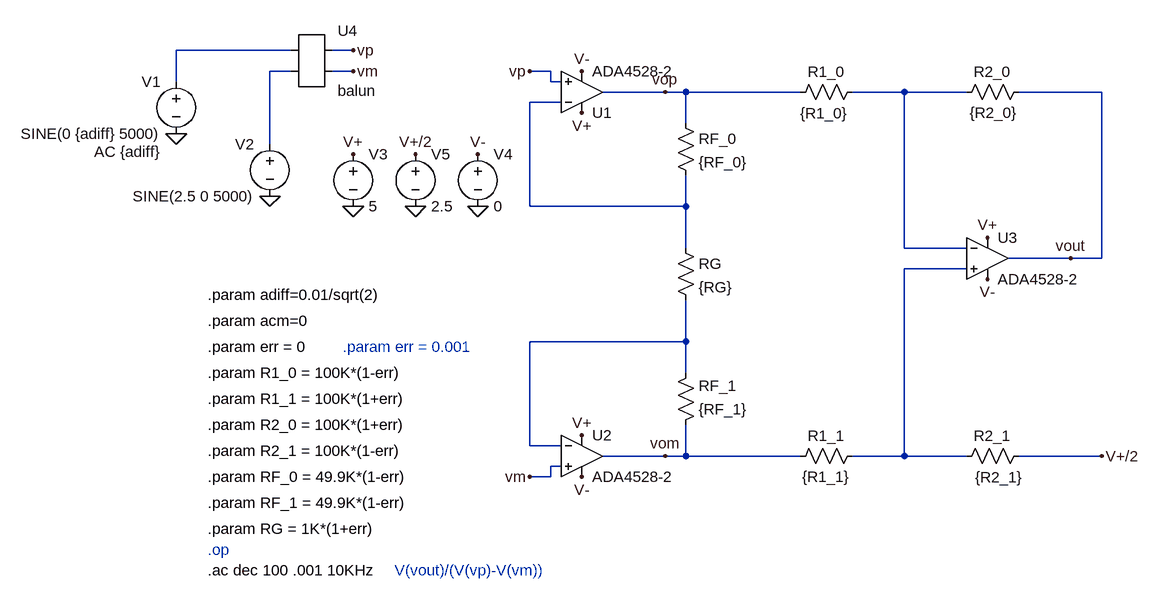
[diagram p0: schematic ADA4528_instrumentation_amp.asc]
ADA4528_instrumentation_amp.asc, the LTspice schematic file:
Version 4
SHEET 1 1708 1000
WIRE -256 96 -432 96
WIRE -160 96 -192 96
WIRE -256 128 -288 128
WIRE -160 128 -192 128
WIRE 144 128 112 128
WIRE -432 144 -432 96
WIRE 144 144 144 128
WIRE 160 144 144 144
WIRE 320 160 224 160
WIRE 352 160 320 160
WIRE 528 160 352 160
WIRE 688 160 608 160
WIRE 784 160 688 160
WIRE 992 160 864 160
WIRE 160 176 112 176
WIRE 352 208 352 160
WIRE -288 240 -288 128
WIRE 112 336 112 176
WIRE 352 336 352 288
WIRE 352 336 112 336
WIRE 352 400 352 336
WIRE 688 400 688 160
WIRE 784 400 688 400
WIRE 944 416 848 416
WIRE 992 416 992 160
WIRE 992 416 944 416
WIRE 784 432 688 432
WIRE 352 544 352 480
WIRE 352 544 112 544
WIRE 352 592 352 544
WIRE 112 704 112 544
WIRE 160 704 112 704
WIRE 320 720 224 720
WIRE 352 720 352 672
WIRE 352 720 320 720
WIRE 528 720 352 720
WIRE 688 720 688 432
WIRE 688 720 608 720
WIRE 784 720 688 720
WIRE 992 720 864 720
WIRE 160 736 144 736
WIRE 144 752 144 736
WIRE 144 752 112 752
FLAG 32 336 0
FLAG -160 336 0
FLAG -160 256 V+
FLAG 32 256 V-
FLAG 320 160 vop
FLAG 320 720 vom
FLAG 944 416 vout
FLAG 112 128 vp
FLAG 112 752 vm
FLAG -432 224 0
FLAG -160 96 vp
FLAG -160 128 vm
FLAG -288 320 0
FLAG 192 128 V-
FLAG 192 688 V+
FLAG 192 752 V-
FLAG 192 192 V+
FLAG 816 384 V+
FLAG 816 448 V-
FLAG -64 256 V+/2
FLAG -64 336 0
FLAG 992 720 V+/2
SYMBOL res 336 192 R0
SYMATTR InstName RF_0
SYMATTR Value {RF_0}
SYMBOL voltage -160 240 R0
WINDOW 123 24 44 Left 2
WINDOW 39 0 0 Left 0
SYMATTR InstName V3
SYMATTR Value 5
SYMBOL voltage 32 240 R0
WINDOW 123 0 0 Left 0
WINDOW 39 0 0 Left 0
SYMATTR InstName V4
SYMATTR Value 0
SYMBOL res 336 688 M180
WINDOW 0 36 76 Left 2
WINDOW 3 36 40 Left 2
SYMATTR InstName RF_1
SYMATTR Value {RF_1}
SYMBOL res 624 144 R90
WINDOW 0 0 56 VBottom 2
WINDOW 3 33 59 VTop 2
SYMATTR InstName R1_0
SYMATTR Value {R1_0}
SYMBOL res 880 144 R90
WINDOW 0 0 56 VBottom 2
WINDOW 3 32 54 VTop 2
SYMATTR InstName R2_0
SYMATTR Value {R2_0}
SYMBOL res 512 736 R270
WINDOW 0 32 56 VTop 2
WINDOW 3 0 56 VBottom 2
SYMATTR InstName R1_1
SYMATTR Value {R1_1}
SYMBOL res 336 384 R0
SYMATTR InstName RG
SYMATTR Value {RG}
SYMBOL AutoGenerated\\balun -224 112 R0
SYMATTR InstName U4
SYMBOL voltage -432 128 M0
WINDOW 123 24 124 Left 2
WINDOW 39 0 0 Left 0
SYMATTR Value2 AC {adiff}
SYMATTR InstName V1
SYMATTR Value SINE(0 {adiff} 5000)
SYMBOL voltage -288 224 M0
WINDOW 123 24 124 Left 2
WINDOW 39 0 0 Left 0
SYMATTR InstName V2
SYMATTR Value SINE(2.5 0 5000)
SYMBOL res 880 704 R90
WINDOW 0 0 56 VBottom 2
WINDOW 3 33 46 VTop 2
SYMATTR InstName R2_1
SYMATTR Value {R2_1}
SYMBOL voltage -64 240 R0
WINDOW 123 24 44 Left 2
WINDOW 39 0 0 Left 0
SYMATTR InstName V5
SYMATTR Value 2.5
SYMBOL Opamps\\ADA4528-2 192 224 M180
SYMATTR InstName U1
SYMBOL Opamps\\ADA4528-2 192 656 R0
SYMATTR InstName U2
SYMBOL Opamps\\ADA4528-2 816 352 R0
SYMATTR InstName U3
TEXT -384 864 Left 2 ;.op
TEXT -384 472 Left 2 !.param adiff=0.01/sqrt(2)
TEXT -384 512 Left 2 !.param acm=0
TEXT -384 896 Left 2 !.ac dec 100 .001 10KHz
TEXT -384 592 Left 2 !.param R1_0 = 100K*(1-err)
TEXT -384 672 Left 2 !.param R2_0 = 100K*(1+err)
TEXT -384 552 Left 2 !.param err = 0
TEXT -384 632 Left 2 !.param R1_1 = 100K*(1+err)
TEXT -384 712 Left 2 !.param R2_1 = 100K*(1-err)
TEXT -384 752 Left 2 !.param RF_0 = 49.9K*(1-err)
TEXT -384 792 Left 2 !.param RF_1 = 49.9K*(1-err)
TEXT -384 832 Left 2 !.param RG = 1K*(1+err)
TEXT -96 896 Left 2 ;V(vout)/(V(vp)-V(vm))
TEXT -176 552 Left 2 ;.param err = 0.001

The netlist it stands for:
* ADA4528_instrumentation_amp.asc
RF_0 vop N004 {RF_0}
V3 V+ 0 5
V4 V- 0 0
RF_1 vom N006 {RF_1}
R1_0 N003 vop {R1_0}
R2_0 vout N003 {R2_0}
R1_1 vom N005 {R1_1}
RG N004 N006 {RG}
* U4: balun (symbol AutoGenerated\balun not available, pins judged from their places): pin1=N001 pin2=N002 pin3=vp pin4=vm
V1 N001 0 SINE(0 {adiff} 5000) AC {adiff}
V2 N002 0 SINE(2.5 0 5000)
R2_1 V+/2 N005 {R2_1}
V5 V+/2 0 2.5
XU1 vp N004 V+ V- vop ADA4528-2  ; pins In+ In- V+ V- OUT
XU2 vm N006 V+ V- vom ADA4528-2  ; pins In+ In- V+ V- OUT
XU3 N005 N003 V+ V- vout ADA4528-2  ; pins In+ In- V+ V- OUT
* .op
.param adiff=0.01/sqrt(2)
.param acm=0
.ac dec 100 .001 10KHz
.param R1_0 = 100K*(1-err)
.param R2_0 = 100K*(1+err)
.param err = 0
.param R1_1 = 100K*(1+err)
.param R2_1 = 100K*(1-err)
.param RF_0 = 49.9K*(1-err)
.param RF_1 = 49.9K*(1-err)
.param RG = 1K*(1+err)
* V(vout)/(V(vp)-V(vm))
* .param err = 0.001
.backanno
.end